# Altium schematic sheet sch_AGV_Output.SchDoc
size A2; SheetNumber: 3; SheetTotal: 6
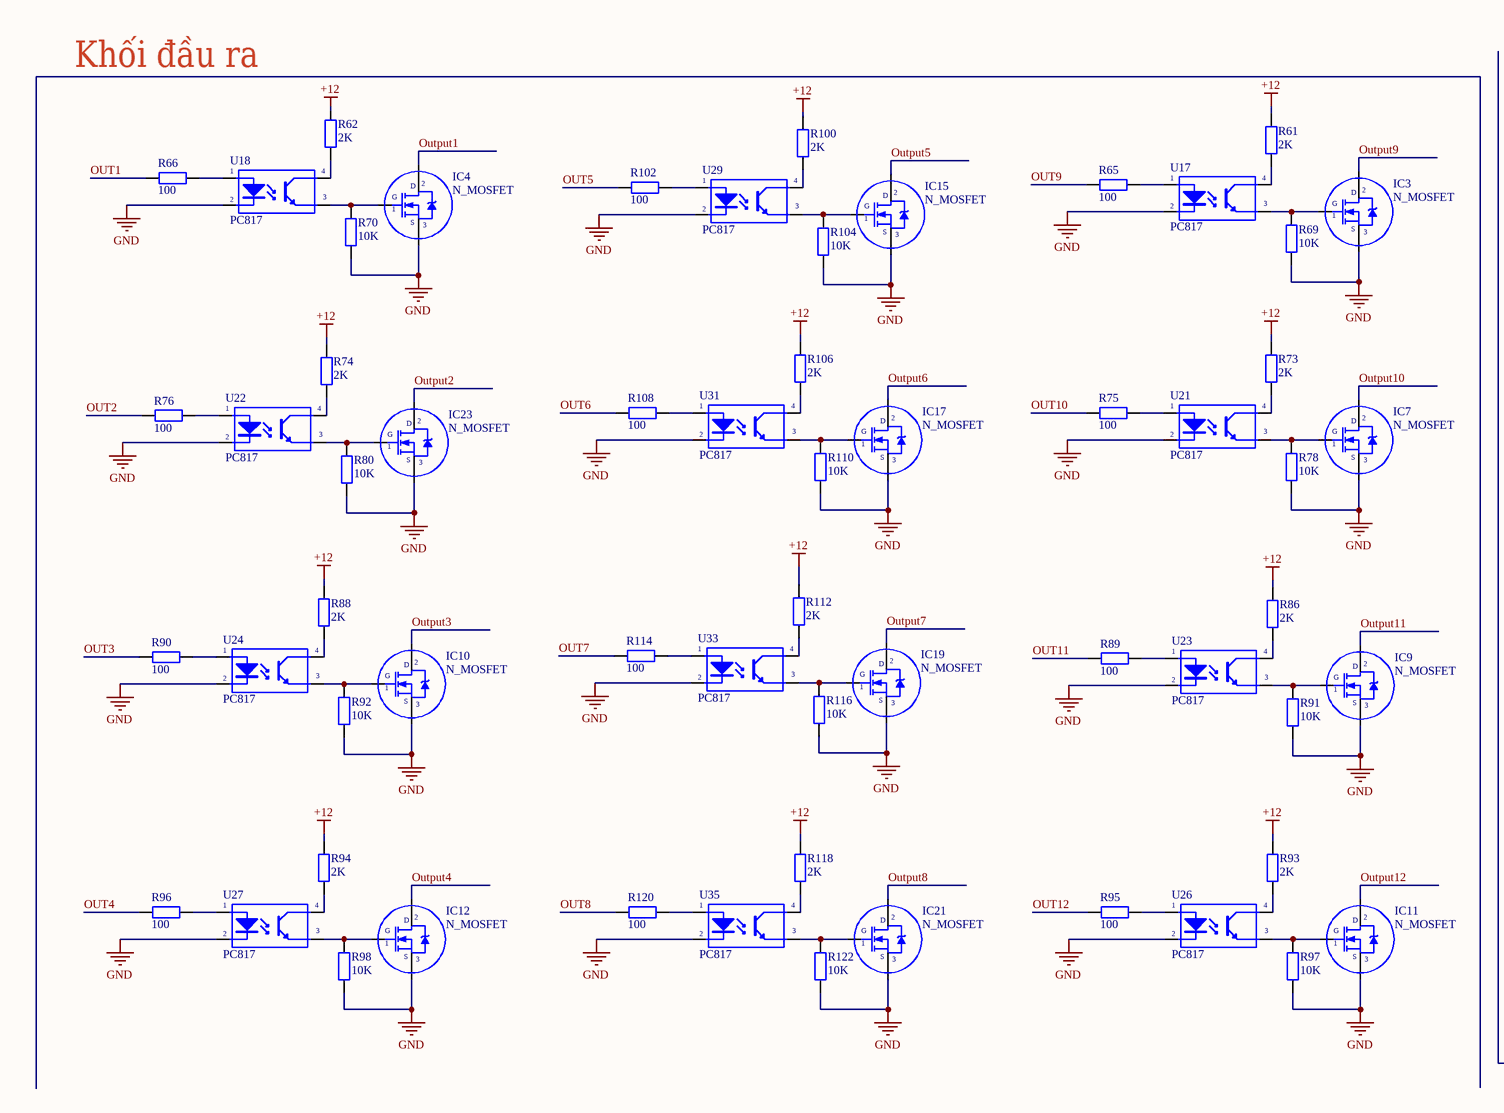
[diagram p0: sch_AGV_Output.SchDoc, left]
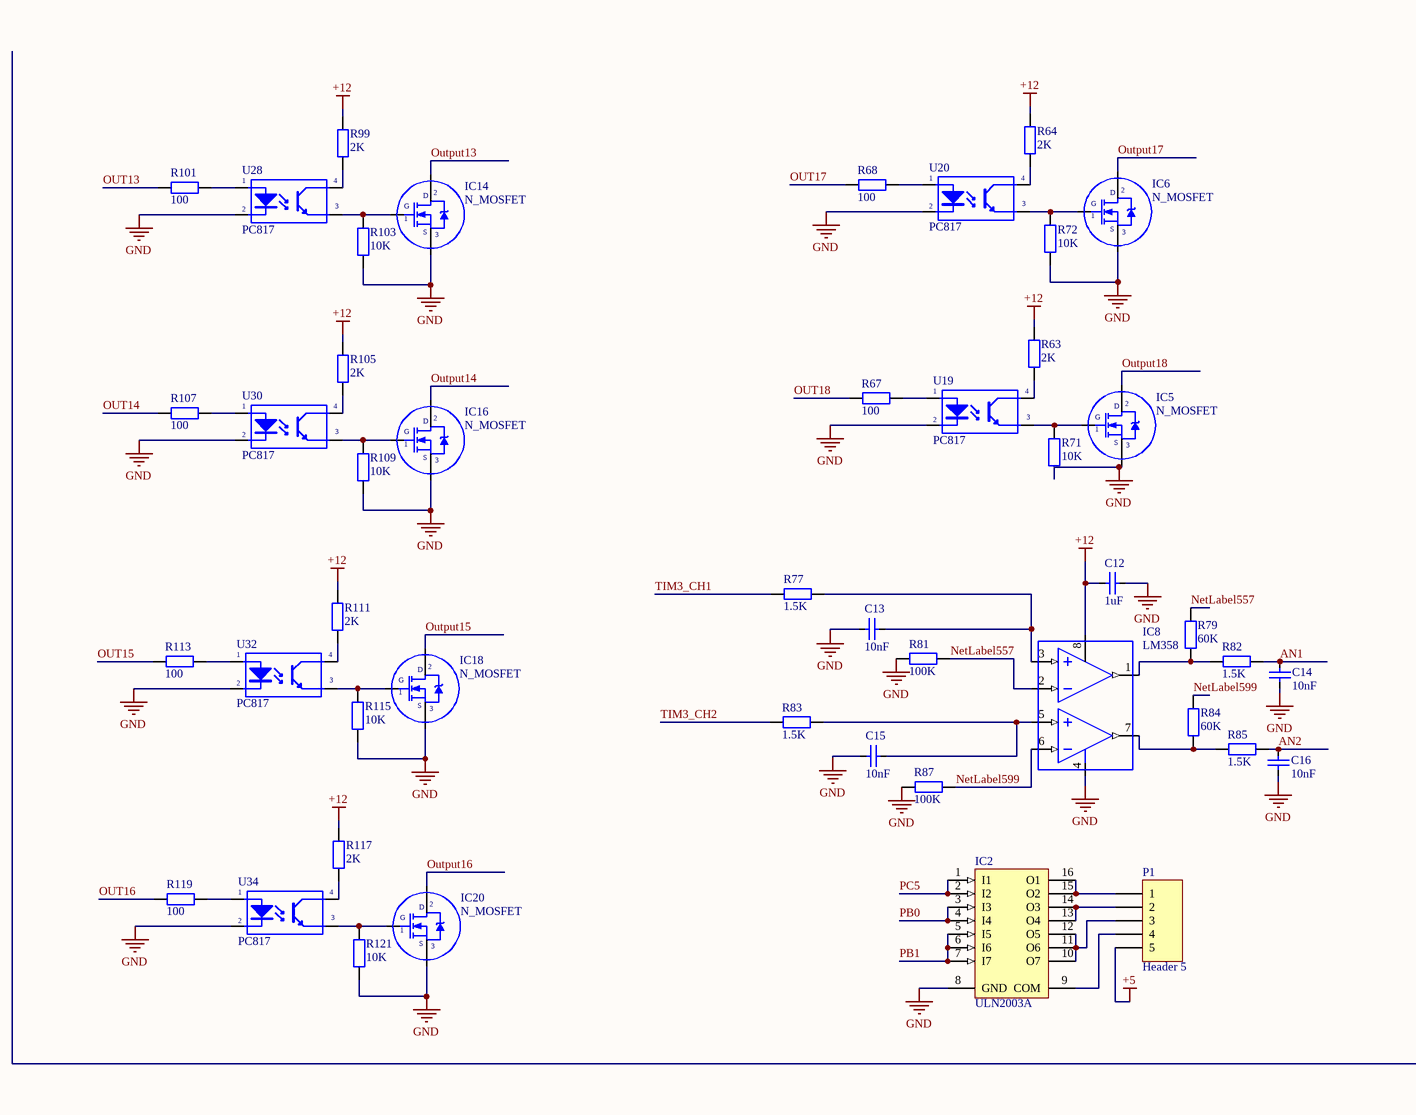
[diagram p1: sch_AGV_Output.SchDoc, right]

## Parts
C12  1uF  [CAP_0805]
C13  10nF  [CAP_0805]
C14  10nF  [CAP_0805]
C15  10nF  [CAP_0805]
C16  10nF  [CAP_0805]
IC2  ULN2003A  [SOIC16]
IC3  N_MOSFET  [SOT23A]
IC4  N_MOSFET  [SOT23A]
IC5  N_MOSFET  [SOT23A]
IC6  N_MOSFET  [SOT23A]
IC7  N_MOSFET  [SOT23A]
IC8  LM358  [SOP8-PP]
IC9  N_MOSFET  [SOT23A]
IC10  N_MOSFET  [SOT23A]
IC11  N_MOSFET  [SOT23A]
IC12  N_MOSFET  [SOT23A]
IC14  N_MOSFET  [SOT23A]
IC15  N_MOSFET  [SOT23A]
IC16  N_MOSFET  [SOT23A]
IC17  N_MOSFET  [SOT23A]
IC18  N_MOSFET  [SOT23A]
IC19  N_MOSFET  [SOT23A]
IC20  N_MOSFET  [SOT23A]
IC21  N_MOSFET  [SOT23A]
IC23  N_MOSFET  [SOT23A]
P1  Header 5  [HDR5]
R61  2K  [RES_SMD_0805]
R62  2K  [RES_SMD_0805]
R63  2K  [RES_SMD_0805]
R64  2K  [RES_SMD_0805]
R65  100  [RES_SMD_0805]
R66  100  [RES_SMD_0805]
R67  100  [RES_SMD_0805]
R68  100  [RES_SMD_0805]
R69  10K  [RES_SMD_0805]
R70  10K  [RES_SMD_0805]
R71  10K  [RES_SMD_0805]
R72  10K  [RES_SMD_0805]
R73  2K  [RES_SMD_0805]
R74  2K  [RES_SMD_0805]
R75  100  [RES_SMD_0805]
R76  100  [RES_SMD_0805]
R77  1.5K  [RES_SMD_0805]
R78  10K  [RES_SMD_0805]
R79  60K  [RES_SMD_0805]
R80  10K  [RES_SMD_0805]
R81  100K  [RES_SMD_0805]
R82  1.5K  [RES_SMD_0805]
R83  1.5K  [RES_SMD_0805]
R84  60K  [RES_SMD_0805]
R85  1.5K  [RES_SMD_0805]
R86  2K  [RES_SMD_0805]
R87  100K  [RES_SMD_0805]
R88  2K  [RES_SMD_0805]
R89  100  [RES_SMD_0805]
R90  100  [RES_SMD_0805]
R91  10K  [RES_SMD_0805]
R92  10K  [RES_SMD_0805]
R93  2K  [RES_SMD_0805]
R94  2K  [RES_SMD_0805]
R95  100  [RES_SMD_0805]
R96  100  [RES_SMD_0805]
R97  10K  [RES_SMD_0805]
R98  10K  [RES_SMD_0805]
R99  2K  [RES_SMD_0805]
R100  2K  [RES_SMD_0805]
R101  100  [RES_SMD_0805]
R102  100  [RES_SMD_0805]
R103  10K  [RES_SMD_0805]
R104  10K  [RES_SMD_0805]
R105  2K  [RES_SMD_0805]
R106  2K  [RES_SMD_0805]
R107  100  [RES_SMD_0805]
R108  100  [RES_SMD_0805]
R109  10K  [RES_SMD_0805]
R110  10K  [RES_SMD_0805]
R111  2K  [RES_SMD_0805]
R112  2K  [RES_SMD_0805]
R113  100  [RES_SMD_0805]
R114  100  [RES_SMD_0805]
R115  10K  [RES_SMD_0805]
R116  10K  [RES_SMD_0805]
R117  2K  [RES_SMD_0805]
R118  2K  [RES_SMD_0805]
R119  100  [RES_SMD_0805]
R120  100  [RES_SMD_0805]
R121  10K  [RES_SMD_0805]
R122  10K  [RES_SMD_0805]
U17  PC817  [DIP4/W0.3]
U18  PC817  [DIP4/W0.3]
U19  PC817  [DIP4/W0.3]
U20  PC817  [DIP4/W0.3]
U21  PC817  [DIP4/W0.3]
U22  PC817  [DIP4/W0.3]
U23  PC817  [DIP4/W0.3]
U24  PC817  [DIP4/W0.3]
U26  PC817  [DIP4/W0.3]
U27  PC817  [DIP4/W0.3]
U28  PC817  [DIP4/W0.3]
U29  PC817  [DIP4/W0.3]
U30  PC817  [DIP4/W0.3]
U31  PC817  [DIP4/W0.3]
U32  PC817  [DIP4/W0.3]
U33  PC817  [DIP4/W0.3]
U34  PC817  [DIP4/W0.3]
U35  PC817  [DIP4/W0.3]

## Nets
+5: P1.5
+12: C12.1 IC8.8(+V) R61.1 R62.1 R63.1 R64.1 R73.1 R74.1 R86.1 R88.1 R93.1 R94.1 R99.1 R100.1 R105.1 R106.1 R111.1 R112.1 R117.1 R118.1
GND: C12.2 C13.1 C14.1 C15.1 C16.1 IC2.8(GND) IC3.3(S) IC4.3(S) IC5.3(S) IC6.3(S) IC7.3(S) IC8.4(-V) IC9.3(S) IC10.3(S) IC11.3(S) IC12.3(S) IC14.3(S) IC15.3(S) IC16.3(S) IC17.3(S) IC18.3(S) IC19.3(S) IC20.3(S) IC21.3(S) IC23.3(S) R69.2 R70.2 R71.2 R72.2 R78.2 R80.2 R81.2 R87.2 R91.2 R92.2 R97.2 R98.2 R103.2 R104.2 R109.2 R110.2 R115.2 R116.2 R121.2 R122.2 U17.2(K) U18.2(K) U19.2(K) U20.2(K) U21.2(K) U22.2(K) U23.2(K) U24.2(K) U26.2(K) U27.2(K) U28.2(K) U29.2(K) U30.2(K) U31.2(K) U32.2(K) U33.2(K) U34.2(K) U35.2(K)
AN1: C14.2 R82.1
AN2: C16.2 R85.1
NetLabel557: IC8.2(IN-) R79.1 R81.1
NetLabel599: IC8.6(IN-) R84.1 R87.1
OUT1: R66.2
OUT2: R76.2
OUT3: R90.2
OUT4: R96.2
OUT5: R102.2
OUT6: R108.2
OUT7: R114.2
OUT8: R120.2
OUT9: R65.2
OUT10: R75.2
OUT11: R89.2
OUT12: R95.2
OUT13: R101.2
OUT14: R107.2
OUT15: R113.2
OUT16: R119.2
OUT17: R68.2
OUT18: R67.2
Output1: IC4.2(D)
Output2: IC23.2(D)
Output3: IC10.2(D)
Output4: IC12.2(D)
Output5: IC15.2(D)
Output6: IC17.2(D)
Output7: IC19.2(D)
Output8: IC21.2(D)
Output9: IC3.2(D)
Output10: IC7.2(D)
Output11: IC9.2(D)
Output12: IC11.2(D)
Output13: IC14.2(D)
Output14: IC16.2(D)
Output15: IC18.2(D)
Output16: IC20.2(D)
Output17: IC6.2(D)
Output18: IC5.2(D)
PB0: IC2.3(I3) IC2.4(I4)
PB1: IC2.5(I5) IC2.6(I6) IC2.7(I7)
PC5: IC2.1(I1) IC2.2(I2)
TIM3_CH1: R77.2
TIM3_CH2: R83.2
NetC13_2: C13.2 IC8.3(IN+) R77.1
NetC15_2: C15.2 IC8.5(IN+) R83.1
NetIC2_9: IC2.9(COM) P1.4
NetIC2_10: IC2.10(O7) IC2.11(O6) IC2.12(O5) P1.3
NetIC2_13: IC2.13(O4) IC2.14(O3) P1.2
NetIC2_15: IC2.15(O2) IC2.16(O1) P1.1
NetIC3_1: IC3.1(G) R69.1 U17.3(E)
NetIC4_1: IC4.1(G) R70.1 U18.3(E)
NetIC5_1: IC5.1(G) R71.1 U19.3(E)
NetIC6_1: IC6.1(G) R72.1 U20.3(E)
NetIC7_1: IC7.1(G) R78.1 U21.3(E)
NetIC8_1: IC8.1(OUT) R79.2 R82.2
NetIC8_7: IC8.7(OUT) R84.2 R85.2
NetIC9_1: IC9.1(G) R91.1 U23.3(E)
NetIC10_1: IC10.1(G) R92.1 U24.3(E)
NetIC11_1: IC11.1(G) R97.1 U26.3(E)
NetIC12_1: IC12.1(G) R98.1 U27.3(E)
NetIC14_1: IC14.1(G) R103.1 U28.3(E)
NetIC15_1: IC15.1(G) R104.1 U29.3(E)
NetIC16_1: IC16.1(G) R109.1 U30.3(E)
NetIC17_1: IC17.1(G) R110.1 U31.3(E)
NetIC18_1: IC18.1(G) R115.1 U32.3(E)
NetIC19_1: IC19.1(G) R116.1 U33.3(E)
NetIC20_1: IC20.1(G) R121.1 U34.3(E)
NetIC21_1: IC21.1(G) R122.1 U35.3(E)
NetIC23_1: IC23.1(G) R80.1 U22.3(E)
NetR61_2: R61.2 U17.4(C)
NetR62_2: R62.2 U18.4(C)
NetR63_2: R63.2 U19.4(C)
NetR64_2: R64.2 U20.4(C)
NetR65_1: R65.1 U17.1(A)
NetR66_1: R66.1 U18.1(A)
NetR67_1: R67.1 U19.1(A)
NetR68_1: R68.1 U20.1(A)
NetR73_2: R73.2 U21.4(C)
NetR74_2: R74.2 U22.4(C)
NetR75_1: R75.1 U21.1(A)
NetR76_1: R76.1 U22.1(A)
NetR86_2: R86.2 U23.4(C)
NetR88_2: R88.2 U24.4(C)
NetR89_1: R89.1 U23.1(A)
NetR90_1: R90.1 U24.1(A)
NetR93_2: R93.2 U26.4(C)
NetR94_2: R94.2 U27.4(C)
NetR95_1: R95.1 U26.1(A)
NetR96_1: R96.1 U27.1(A)
NetR99_2: R99.2 U28.4(C)
NetR100_2: R100.2 U29.4(C)
NetR101_1: R101.1 U28.1(A)
NetR102_1: R102.1 U29.1(A)
NetR105_2: R105.2 U30.4(C)
NetR106_2: R106.2 U31.4(C)
NetR107_1: R107.1 U30.1(A)
NetR108_1: R108.1 U31.1(A)
NetR111_2: R111.2 U32.4(C)
NetR112_2: R112.2 U33.4(C)
NetR113_1: R113.1 U32.1(A)
NetR114_1: R114.1 U33.1(A)
NetR117_2: R117.2 U34.4(C)
NetR118_2: R118.2 U35.4(C)
NetR119_1: R119.1 U34.1(A)
NetR120_1: R120.1 U35.1(A)

## Notes on the sheet
- Khối đầu ra

## Library data of the parts
C12-C16 = CapSMD: Capacitor; Value: 33p; Published: 8-Jun-2000; LatestRevisionDate: 17-Jul-2002; LatestRevisionNote: Re-released for DXP Platform.; PackageReference: RAD-0.3; Publisher: Altium Limited
IC2 = ULN2003A: High-Voltage, High-Current Darlington Array; LatestRevisionNote: Stylized 3D Model Added.; Publisher: Altium Limited; Value: ULN2003A
IC3-IC7 IC9-IC12 IC14-IC21 IC23 = MOSFET_N: Generic N Channel MOSFET
IC8 = LM358: Low-Power Dual Operational Amplifier; Value: LM358
P1 = Header 5: Header, 5-Pin; LatestRevisionDate: 17-Jul-2002; LatestRevisionNote: Re-released for DXP Platform.; Publisher: Altium Limited
R61-R122 = Res: Resistor; Manufacturer: Generic Components; Class: Passive; Published: 08/06/2000; Publisher: Altium Hobart Technology Centre
U17-U24 U26-U35 = PC817: Single Opto; Value: PC817